# EAGLE schematic Subrack_Bus (EAGLE 9.0.1)
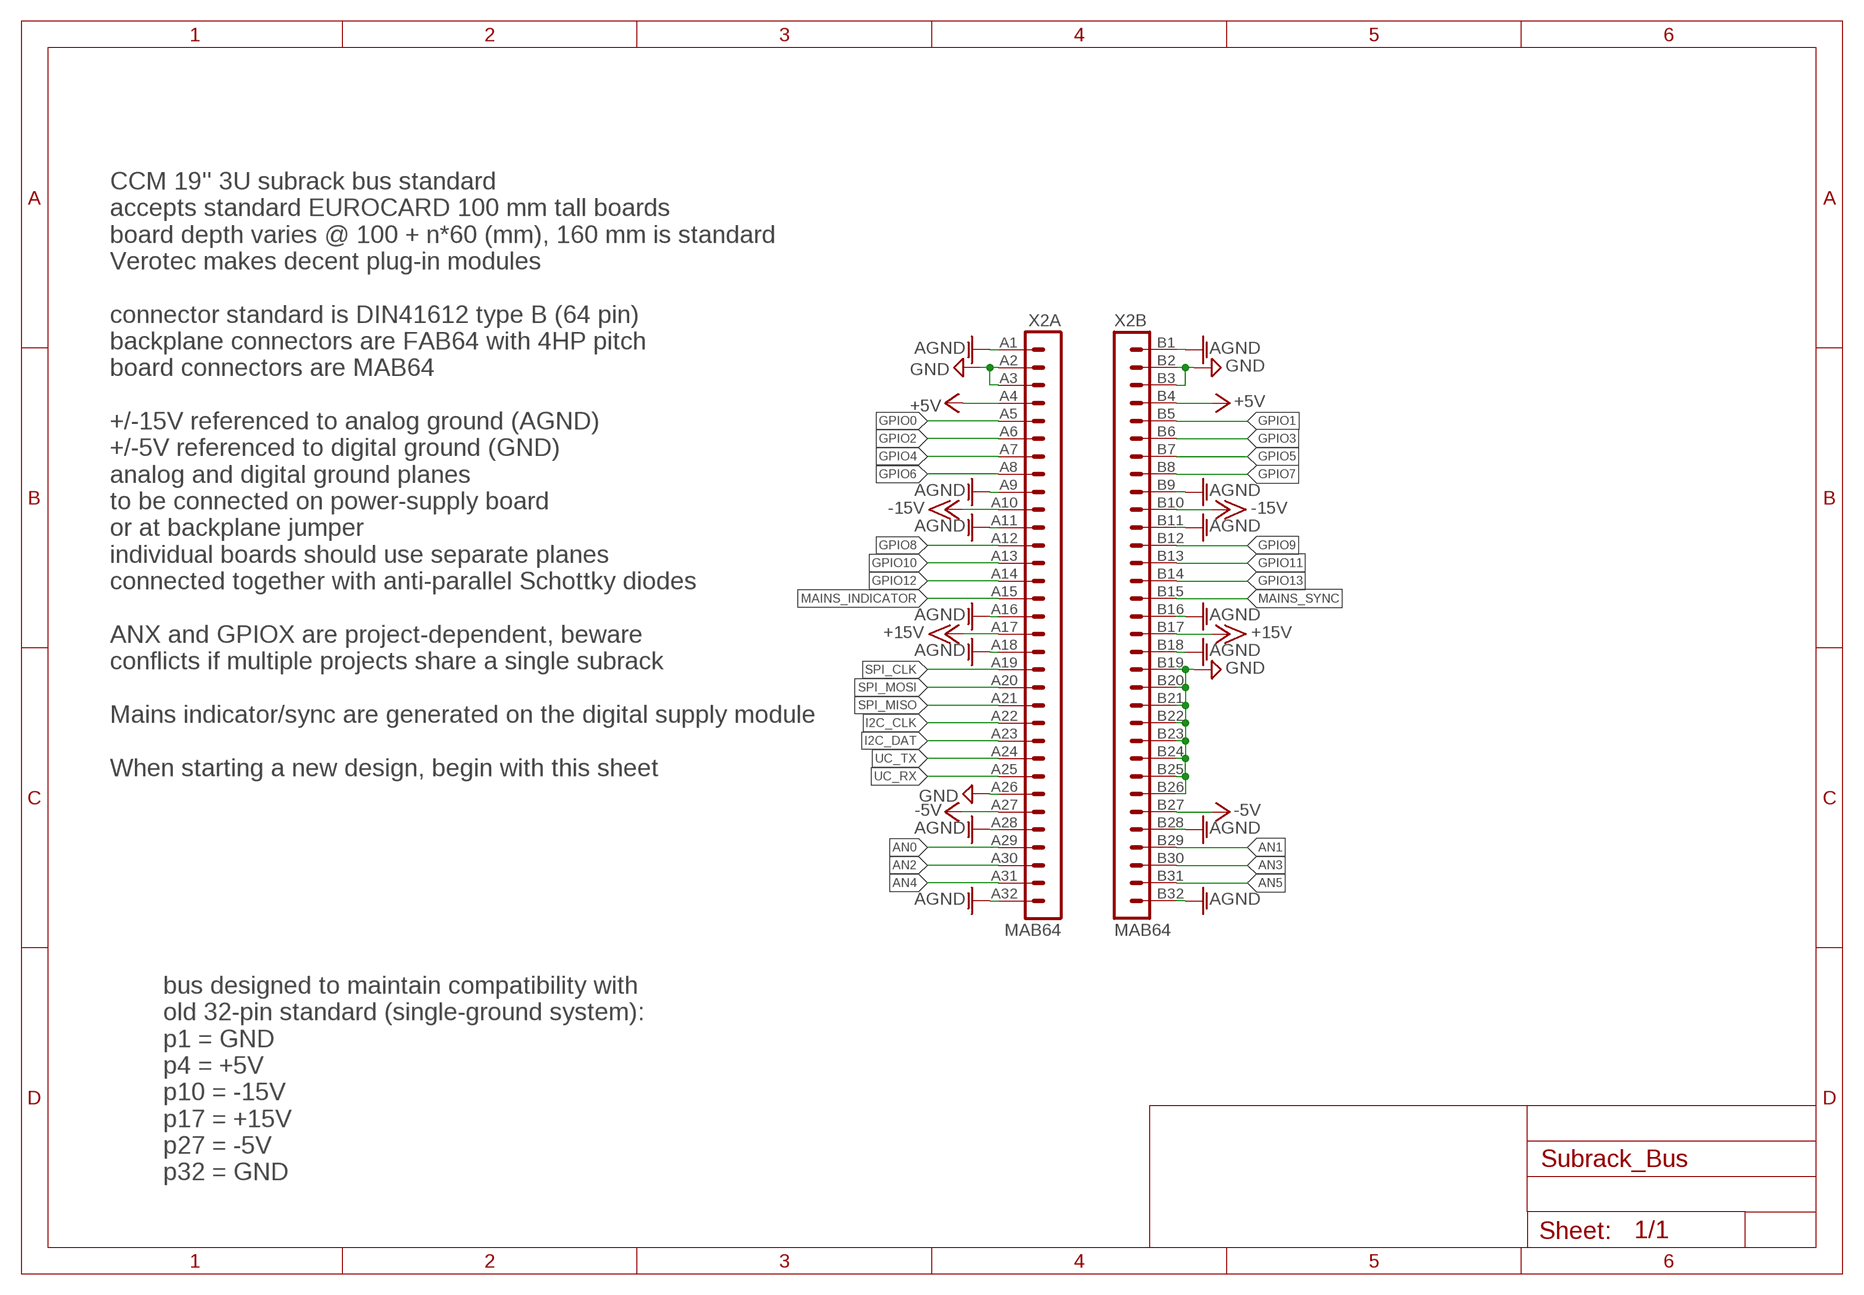
[diagram p0: schematic, sheet 1]

## Parts
X2  MAB64  [MAB64]

## Nets
+5V: X2.A4 X2.B4
+15V: X2.A17 X2.B17
-5V: X2.A27 X2.B27
-15V: X2.A10 X2.B10
AGND: X2.A1 X2.A9 X2.A11 X2.A16 X2.A18 X2.A28 X2.A32 X2.B1 X2.B9 X2.B11 X2.B16 X2.B18 X2.B28 X2.B32
AN0: X2.A29
AN1: X2.B29
AN2: X2.A30
AN3: X2.B30
AN4: X2.A31
AN5: X2.B31
GND: X2.A2 X2.A3 X2.A26 X2.B2 X2.B3 X2.B19 X2.B20 X2.B21 X2.B22 X2.B23 X2.B24 X2.B25 X2.B26
GPIO0: X2.A5
GPIO1: X2.B5
GPIO2: X2.A6
GPIO3: X2.B6
GPIO4: X2.A7
GPIO5: X2.B7
GPIO6: X2.A8
GPIO7: X2.B8
GPIO8: X2.A12
GPIO9: X2.B12
GPIO10: X2.A13
GPIO11: X2.B13
GPIO12: X2.A14
GPIO13: X2.B14
I2C_CLK: X2.A22
I2C_DAT: X2.A23
MAINS_INDICATOR: X2.A15
MAINS_SYNC: X2.B15
SPI_CLK: X2.A19
SPI_MISO: X2.A21
SPI_MOSI: X2.A20
UC_RX: X2.A25
UC_TX: X2.A24

## Notes on the sheet
- CCM 19'' 3U subrack bus standard
  accepts standard EUROCARD 100 mm tall boards
  board depth varies @ 100 + n*60 (mm), 160 mm is standard
  Verotec makes decent plug-in modules
  
  connector standard is DIN41612 type B (64 pin)
  backplane connectors are FAB64 with 4HP pitch 
  board connectors are MAB64
  
  +/-15V referenced to analog ground (AGND)
  +/-5V referenced to digital ground (GND)
  analog and digital ground planes
  to be connected on power-supply board
  or at backplane jumper
  individual boards should use separate planes
  connected together with anti-parallel Schottky diodes
  
  ANX and GPIOX are project-dependent, beware 
  conflicts if multiple projects share a single subrack
  
  Mains indicator/sync are generated on the digital supply module
  
  When starting a new design, begin with this sheet
- bus designed to maintain compatibility with 
  old 32-pin standard (single-ground system):
  p1 = GND
  p4 = +5V
  p10 = -15V
  p17 = +15V
  p27 = -5V
  p32 = GND

## Library data of the parts
X2 = noah:MAB64: CONNECTOR male, 94 pins, type B, rows AB, grid 2.54 mm